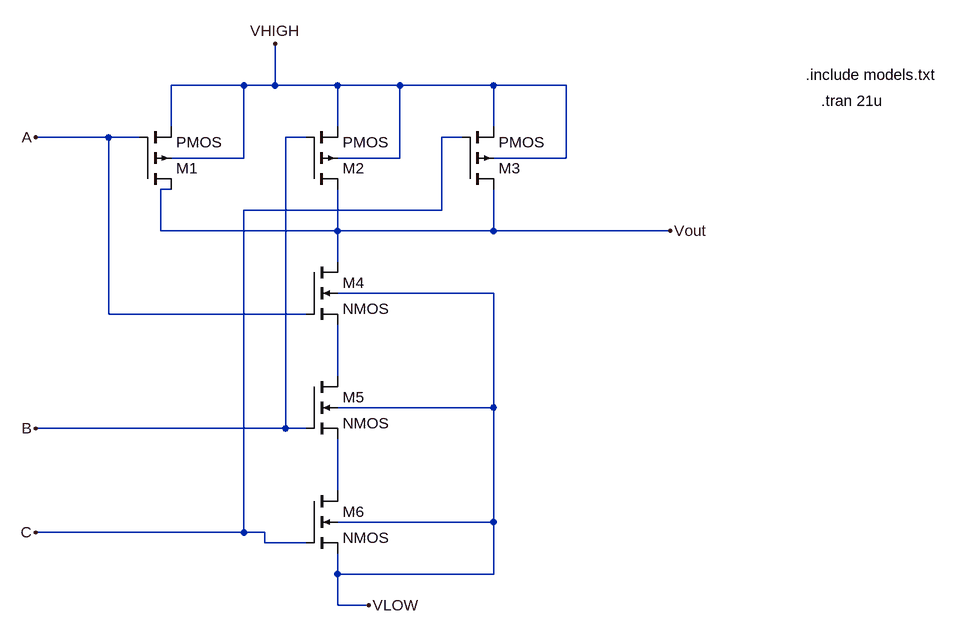
[diagram p0: schematic NAND.asc]
NAND.asc, the LTspice schematic file:
Version 4
SHEET 1 1728 960
WIRE 192 -48 80 -48
WIRE 240 -48 240 -112
WIRE 240 -48 192 -48
WIRE 336 -48 240 -48
WIRE 432 -48 336 -48
WIRE 576 -48 432 -48
WIRE 688 -48 576 -48
WIRE 80 16 80 -48
WIRE 336 16 336 -48
WIRE 576 16 576 -48
WIRE -16 32 -128 32
WIRE 32 32 -16 32
WIRE 288 32 256 32
WIRE 528 32 496 32
WIRE 192 64 192 -48
WIRE 192 64 80 64
WIRE 432 64 432 -48
WIRE 432 64 336 64
WIRE 688 64 688 -48
WIRE 688 64 576 64
WIRE 80 112 64 112
WIRE 496 144 496 32
WIRE 496 144 192 144
WIRE 64 176 64 112
WIRE 336 176 336 112
WIRE 336 176 64 176
WIRE 576 176 576 112
WIRE 576 176 336 176
WIRE 848 176 576 176
WIRE 336 224 336 176
WIRE 576 272 336 272
WIRE -16 304 -16 32
WIRE 288 304 -16 304
WIRE 336 400 336 320
WIRE 576 448 576 272
WIRE 576 448 336 448
WIRE 256 480 256 32
WIRE 256 480 -128 480
WIRE 288 480 256 480
WIRE 336 576 336 496
WIRE 576 624 576 448
WIRE 576 624 336 624
WIRE 192 640 192 144
WIRE 192 640 -128 640
WIRE 224 640 192 640
WIRE 224 656 224 640
WIRE 288 656 224 656
WIRE 336 704 336 672
WIRE 576 704 576 624
WIRE 576 704 336 704
WIRE 336 752 336 704
WIRE 384 752 336 752
FLAG -128 32 A
FLAG -128 480 B
FLAG -128 640 C
FLAG 384 752 VLOW
FLAG 240 -112 VHIGH
FLAG 848 176 Vout
SYMBOL pmos4 32 112 M180
SYMATTR InstName M1
SYMATTR Value2 l=50n w=1u
SYMBOL pmos4 288 112 M180
SYMATTR InstName M2
SYMATTR Value2 l=50n w=1u
SYMBOL pmos4 528 112 M180
SYMATTR InstName M3
SYMATTR Value2 l=50n w=1u
SYMBOL nmos4 288 224 R0
SYMATTR InstName M4
SYMATTR Value2 l=50n w=0.5u
SYMBOL nmos4 288 400 R0
SYMATTR InstName M5
SYMATTR Value2 l=50n w=0.5u
SYMBOL nmos4 288 576 R0
SYMATTR InstName M6
SYMATTR Value2 l=50n w=0.5u
TEXT 1056 -64 Left 2 !.include models.txt
TEXT 1080 -24 Left 2 !.tran 21u

The netlist it stands for:
* NAND.asc
M1 Vout A VHIGH VHIGH PMOS l=50n w=1u
M2 Vout B VHIGH VHIGH PMOS l=50n w=1u
M3 Vout C VHIGH VHIGH PMOS l=50n w=1u
M4 Vout A N001 VLOW NMOS l=50n w=0.5u
M5 N001 B N002 VLOW NMOS l=50n w=0.5u
M6 N002 C VLOW VLOW NMOS l=50n w=0.5u
.model NMOS NMOS
.model PMOS PMOS
.lib standard.mos
.include models.txt
.tran 21u
.backanno
.end